# Altium schematic sheet control.SchDoc
size A4; SheetNumber: 7; SheetTotal: 7
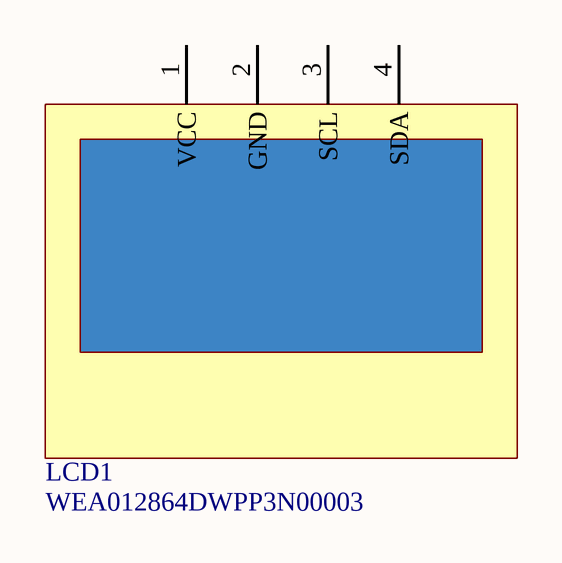
[diagram p0: control.SchDoc]

## Parts
LCD1  WEA012864DWPP3N00003  [WEA012864DWPP3N00003]

## Nets

Not connected (* = marked no-connect by the designer): LCD1 1(VCC) 2(GND) 3(SCL) 4(SDA)

## Library data of the parts
LCD1 = WEA012864DWPP3N00003: OLED 0.96" display, 128x64, white,  IC SSD1306BZ, I2C, 3v, -40...+80°С; Manufacturer: Winstar; Part Number: WEA012864DWPP3N00003; Item: WEA012864DWPP3N00003; Supplier 1: ChipDip; Supplier Part Number 1: 8001808254; Case: none; HelpURL: https://www.compel.ru/item-pdf/bf9bb7bf1ce7223b4efcb84e5467b96d/pn/winstar~wea012864dwpp3n00003.pdf; Category: OLED displays